# EAGLE design openmv (EAGLE 6.4)
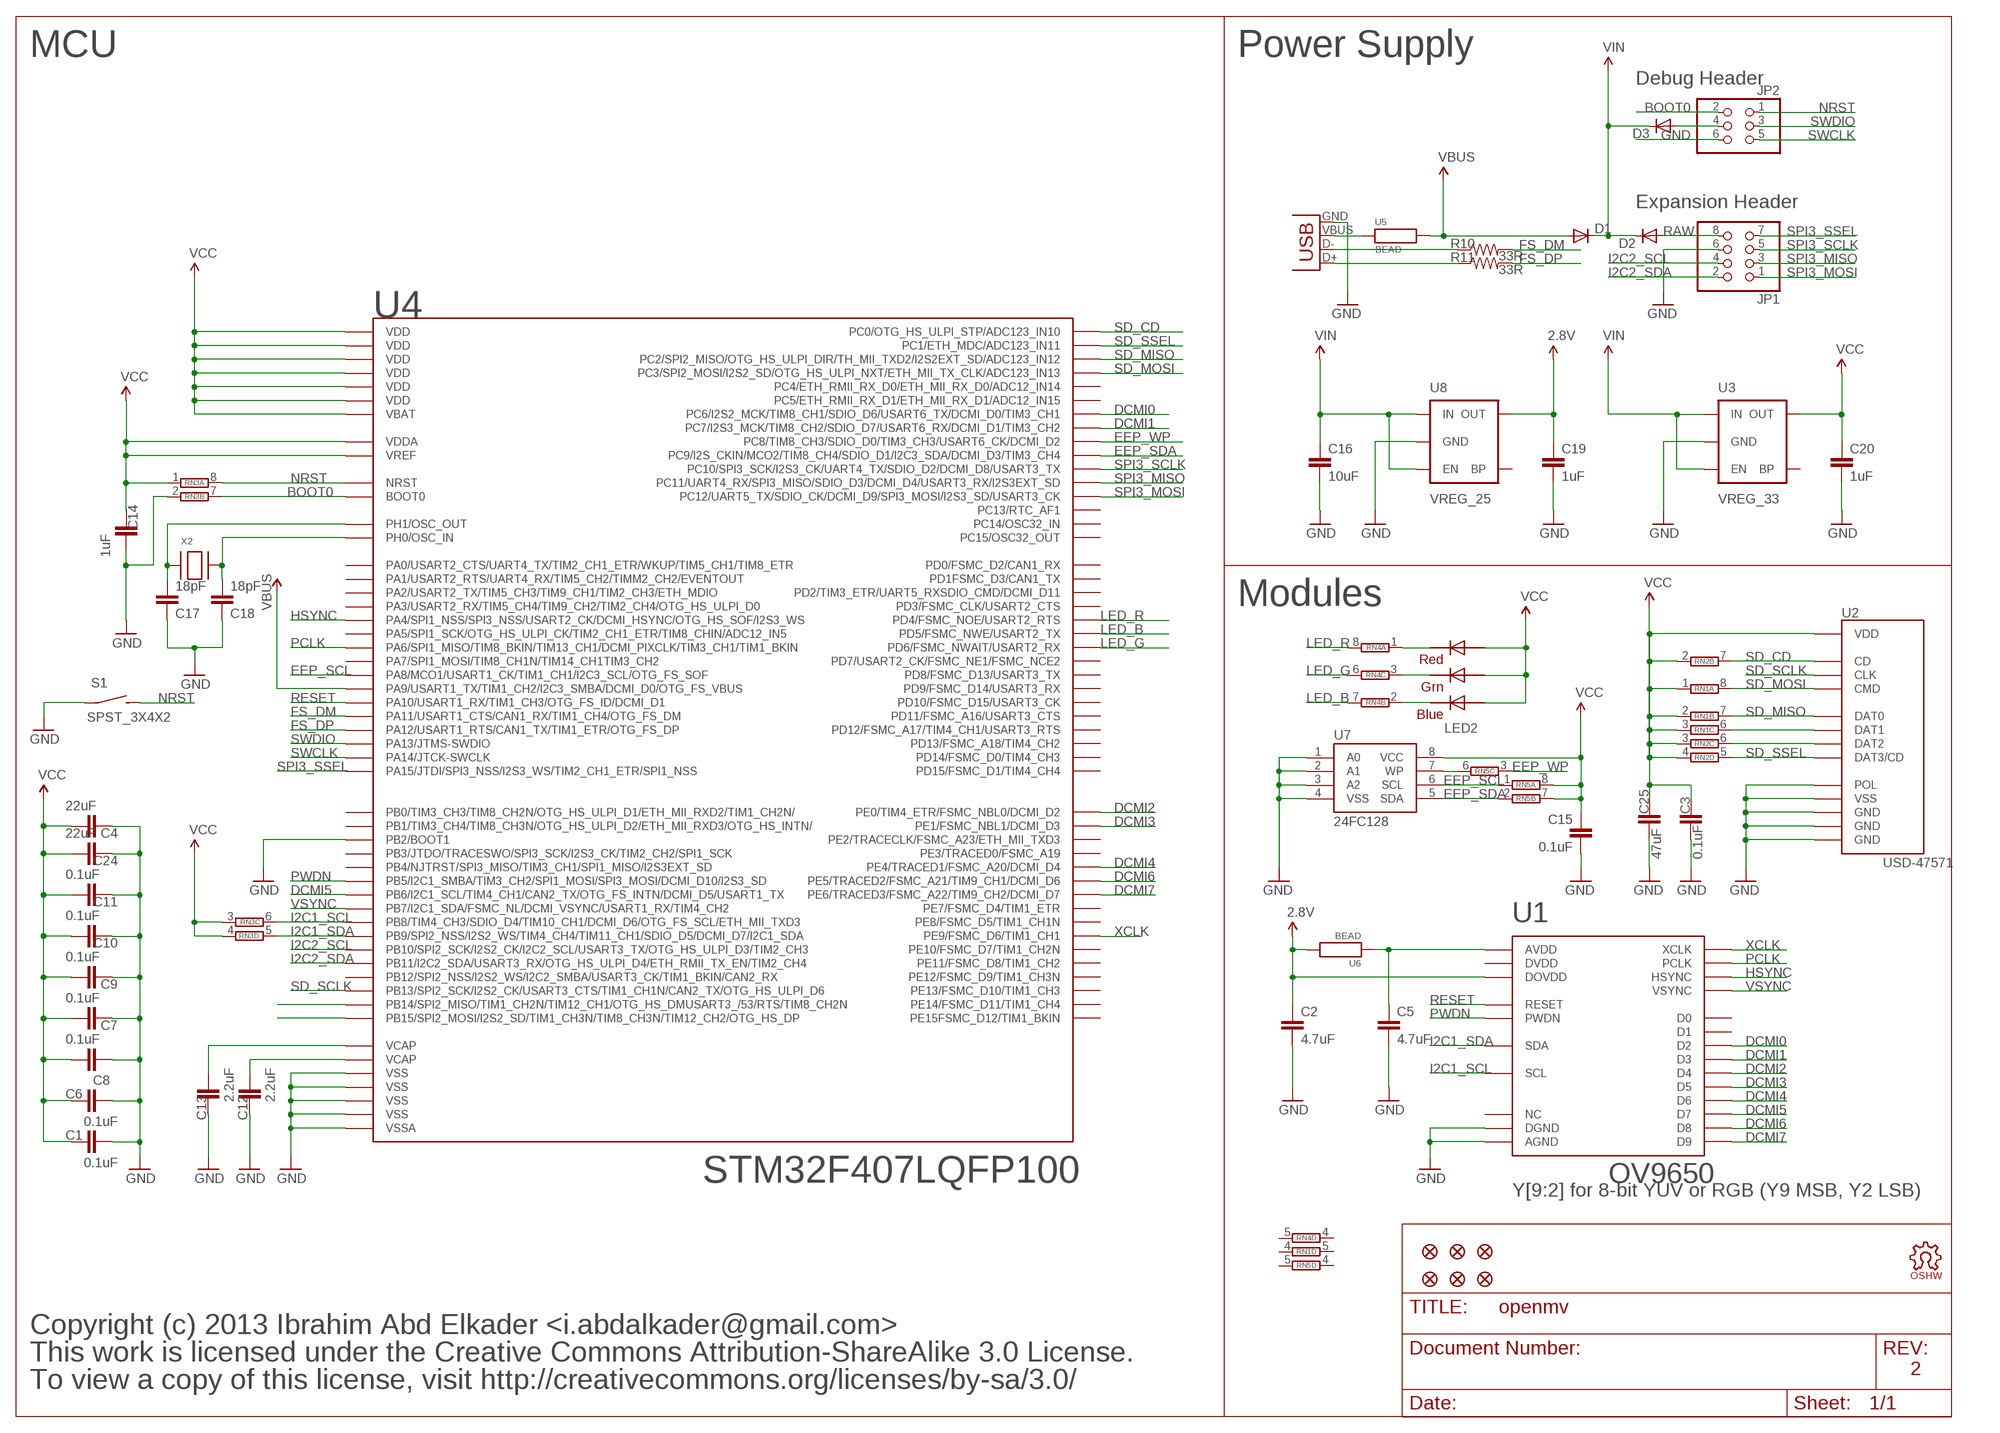
[diagram p0: schematic, sheet 1]

## Parts
C1  0.1uF  CAP0402-CAP  [0402-CAP]
C2  4.7uF  CAP0402-CAP  [0402-CAP]
C3  0.1uF  CAP0402-CAP  [0402-CAP]
C4  22uF  CAP0805  [0805]
C5  4.7uF  CAP0402-CAP  [0402-CAP]
C6  0.1uF  CAP0402-CAP  [0402-CAP]
C7  0.1uF  CAP0402-CAP  [0402-CAP]
C8  0.1uF  CAP0402-CAP  [0402-CAP]
C9  0.1uF  CAP0402-CAP  [0402-CAP]
C10  0.1uF  CAP0402-CAP  [0402-CAP]
C11  0.1uF  CAP0402-CAP  [0402-CAP]
C12  2.2uF  CAP0402-CAP  [0402-CAP]
C13  2.2uF  CAP0402-CAP  [0402-CAP]
C14  1uF  CAP0402-CAP  [0402-CAP]
C15  0.1uF  CAP0402-CAP  [0402-CAP]
C16  10uF  CAP0805  [0805]
C17  18pF  CAP0402-CAP  [0402-CAP]
C18  18pF  CAP0402-CAP  [0402-CAP]
C19  1uF  CAP0402-CAP  [0402-CAP]
C20  1uF  CAP0402-CAP  [0402-CAP]
C24  22uF  CAP0805  [0805]
C25  47uF  CAP0805  [0805]
D1  DIODESOD  [SOD-323]
D2  DIODESOD  [SOD-323]
D3  DIODESOD  [SOD-323]
JP1  PINHD-2X4  [2X04]
JP2  PINHD-2X3  [2X03]
JP3  FIDUCIAL1X2  [FIDUCIAL-1X2]
JP4  FIDUCIAL1X2  [FIDUCIAL-1X2]
JP5  FIDUCIAL1X2  [FIDUCIAL-1X2]
JP6  FIDUCIAL1X2  [FIDUCIAL-1X2]
JP7  FIDUCIAL1X2  [FIDUCIAL-1X2]
JP8  FIDUCIAL1X2  [FIDUCIAL-1X2]
LED2  RGBLED5050  [RGBLED5050]
LOGO1  OSHW_LOGO_FILLX0150-NT  [OSHW_FILLX150_NOTEXT]
R10  33R  RESISTOR0402-RES  [0402-RES]
R11  33R  RESISTOR0402-RES  [0402-RES]
RN1  4R-NCAT16  [CAT16]
RN2  4R-NCAT16  [CAT16]
RN3  4R-NCAT16  [CAT16]
RN4  4R-NCAT16  [CAT16]
RN5  4R-NCAT16  [CAT16]
S1  SPST_3X4X2  [3X4X2TACT]
U1  OV9650  [OV9650]
U2  USD-47571  [USD-47571]
U3  VREG_33  V_REG_LDOSMD  [SOT23-5]
U4  STM32F407LQFP100  [LQFP100]
U5  BEAD  [0402-CAP]
U6  BEAD  [0402-CAP]
U7  24FC128  [MSOP8]
U8  VREG_25  V_REG_LDOSMD  [SOT23-5]
X1  USB-MICROB  [USB-MICROB]
X2  XTALNX5032  [NX5032]

## Nets
2.8V: C2.1 C19.1 U1.P$11(DOVDD) U6.2 U8.5(OUT)
BOOT0: JP2.2 RN3.7 U4.94(BOOT0)
DCMI0: U1.P$19(D2) U4.63(PC6/I2S2_MCK/TIM8_CH1/SDIO_D6/USART6_TX/DCMI_D0/TIM3_CH1)
DCMI1: U1.P$21(D3) U4.64(PC7/I2S3_MCK/TIM8_CH2/SDIO_D7/USART6_RX/DCMI_D1/TIM3_CH2)
DCMI2: U1.P$22(D4) U4.97(PE0/TIM4_ETR/FSMC_NBL0/DCMI_D2)
DCMI3: U1.P$20(D5) U4.98(PE1/FSMC_NBL1/DCMI_D3)
DCMI4: U1.P$18(D6) U4.3(PE4/TRACED1/FSMC_A20/DCMI_D4)
DCMI5: U1.P$16(D7) U4.92(PB6/I2C1_SCL/TIM4_CH1/CAN2_TX/OTG_FS_INTN/DCMI_D5/USART1_TX)
DCMI6: U1.P$14(D8) U4.4(PE5/TRACED2/FSMC_A21/TIM9_CH1/DCMI_D6)
DCMI7: U1.P$12(D9) U4.5(PE6/TRACED3/FSMC_A22/TIM9_CH2/DCMI_D7)
EEP_SCL: RN5.1 U4.67(PA8/MCO1/USART1_CK/TIM1_CH1/I2C3_SCL/OTG_FS_SOF) U7.6(SCL)
EEP_SDA: RN5.2 U4.66(PC9/I2S_CKIN/MCO2/TIM8_CH4/SDIO_D1/I2C3_SDA/DCMI_D3/TIM3_CH4) U7.5(SDA)
EEP_WP: RN5.3 U4.65(PC8/TIM8_CH3/SDIO_D0/TIM3_CH3/USART6_CK/DCMI_D2)
FS_DM: R10.2 U4.70(PA11/USART1_CTS/CAN1_RX/TIM1_CH4/OTG_FS_DM)
FS_DP: R11.2 U4.71(PA12/USART1_RTS/CAN1_TX/TIM1_ETR/OTG_FS_DP)
GND: C1.1 C2.2 C3.2 C4.1 C5.2 C6.1 C7.2 C8.1 C9.2 C10.2 C11.2 C12.2 C13.2 C14.1 C15.2 C16.2 C17.1 C18.1 C19.2 C20.2 C24.1 C25.2 JP1.6 JP2.6 RN3.2 S1.P$1(P) U1.P$2(AGND) U1.P$15(DGND) U2.G$1(GND) U2.G$2(GND) U2.G$3(GND) U2.G$4(POL) U2.P$6(VSS) U3.2(GND) U4.10(VSS) U4.20(VSSA) U4.27(VSS) U4.37(PB2/BOOT1) U4.74(VSS) U4.99(VSS) U7.1(A0) U7.2(A1) U7.3(A2) U7.4(VSS) U8.2(GND) X1.GND
HSYNC: U1.P$9(HSYNC) U4.29(PA4/SPI1_NSS/SPI3_NSS/USART2_CK/DCMI_HSYNC/OTG_HS_SOF/I2S3_WS)
I2C1_SCL: RN3.6 U1.P$5(SCL) U4.95(PB8/TIM4_CH3/SDIO_D4/TIM10_CH1/DCMI_D6/OTG_FS_SCL/ETH_MII_TXD3)
I2C1_SDA: RN3.5 U1.P$3(SDA) U4.96(PB9/SPI2_NSS/I2S2_WS/TIM4_CH4/TIM11_CH1/SDIO_D5/DCMI_D7/I2C1_SDA)
I2C2_SCL: JP1.4 U4.47(PB10/SPI2_SCK/I2S2_CK/I2C2_SCL/USART3_TX/OTG_HS_ULPI_D3/TIM2_CH3)
I2C2_SDA: JP1.2 U4.48(PB11/I2C2_SDA/USART3_RX/OTG_HS_ULPI_D4/ETH_RMII_TX_EN/TIM2_CH4)
LED_B: RN4.7 U4.86(PD5/FSMC_NWE/USART2_TX)
LED_G: RN4.6 U4.87(PD6/FSMC_NWAIT/USART2_RX)
LED_R: RN4.8 U4.85(PD4/FSMC_NOE/USART2_RTS)
N$1: RN1.6 U2.P$8(DAT1)
N$2: RN2.6 U2.P$1(DAT2)
N$3: LED2.5(RED_C) RN4.1
N$4: LED2.6(GREEN_C) RN4.3
N$5: LED2.4(BLUE_C) RN4.2
N$6: C17.2 U4.13(PH1/OSC_OUT) X2.P$1
N$8: C18.2 U4.12(PH0/OSC_IN) X2.P$2
N$9: RN5.6 U7.7(WP)
N$10: C5.1 U1.P$4(AVDD) U6.1
N$11: D3.2(A) JP2.4
N$12: U4.53(PB14/SPI2_MISO/TIM1_CH2N/TIM12_CH1/OTG_HS_DMUSART3_/53/RTS/TIM8_CH2N)
N$13: U4.54(PB15/SPI2_MOSI/I2S2_SD/TIM1_CH3N/TIM8_CH3N/TIM12_CH2/OTG_HS_DP)
N$20: R10.1 X1.D-
N$21: R11.1 X1.D+
N$22: U5.1 X1.VBUS
NRST: JP2.1 RN3.8 S1.P$2(S) U4.14(NRST)
PCLK: U1.P$17(PCLK) U4.31(PA6/SPI1_MISO/TIM8_BKIN/TIM13_CH1/DCMI_PIXCLK/TIM3_CH1/TIM1_BKIN)
PWDN: U1.P$8(PWDN) U4.91(PB5/I2C1_SMBA/TIM3_CH2/SPI1_MOSI/SPI3_MOSI/DCMI_D10/I2S3_SD)
RAW: D2.2(A) JP1.8
RESET: U1.P$6(RESET) U4.69(PA10/USART1_RX/TIM1_CH3/OTG_FS_ID/DCMI_D1)
SD_CD: RN2.7 U2.G$5(CD) U4.15(PC0/OTG_HS_ULPI_STP/ADC123_IN10)
SD_MISO: RN1.7 U2.P$7(DAT0) U4.17(PC2/SPI2_MISO/OTG_HS_ULPI_DIR/TH_MII_TXD2/I2S2EXT_SD/ADC123_IN12)
SD_MOSI: RN1.8 U2.P$3(CMD) U4.18(PC3/SPI2_MOSI/I2S2_SD/OTG_HS_ULPI_NXT/ETH_MII_TX_CLK/ADC123_IN13)
SD_SCLK: U2.P$5(CLK) U4.52(PB13/SPI2_SCK/I2S2_CK/USART3_CTS/TIM1_CH1N/CAN2_TX/OTG_HS_ULPI_D6)
SD_SSEL: RN2.5 U2.P$2(DAT3/CD) U4.16(PC1/ETH_MDC/ADC123_IN11)
SPI3_MISO: JP1.3 U4.79(PC11/UART4_RX/SPI3_MISO/SDIO_D3/DCMI_D4/USART3_RX/I2S3EXT_SD)
SPI3_MOSI: JP1.1 U4.80(PC12/UART5_TX/SDIO_CK/DCMI_D9/SPI3_MOSI/I2S3_SD/USART3_CK)
SPI3_SCLK: JP1.5 U4.78(PC10/SPI3_SCK/I2S3_CK/UART4_TX/SDIO_D2/DCMI_D8/USART3_TX)
SPI3_SSEL: JP1.7 U4.77(PA15/JTDI/SPI3_NSS/I2S3_WS/TIM2_CH1_ETR/SPI1_NSS)
SWCLK: JP2.5 U4.76(PA14/JTCK-SWCLK)
SWDIO: JP2.3 U4.72(PA13/JTMS-SWDIO)
VBUS: D1.2(A) U4.68(PA9/USART1_TX/TIM1_CH2/I2C3_SMBA/DCMI_D0/OTG_FS_VBUS) U5.2
VCAP1: C13.1 U4.49(VCAP)
VCAP2: C12.1 U4.73(VCAP)
VCC: C1.2 C3.1 C4.2 C6.2 C7.1 C8.2 C9.1 C10.1 C11.1 C14.2 C15.1 C20.1 C24.2 C25.1 LED2.1(GREEN_A) LED2.2(RED_A) LED2.3(BLUE_A) RN1.1 RN1.2 RN1.3 RN2.2 RN2.3 RN2.4 RN3.1 RN3.3 RN3.4 RN5.7 RN5.8 U2.P$4(VDD) U3.5(OUT) U4.6(VBAT) U4.11(VDD) U4.19(VDD) U4.21(VREF) U4.22(VDDA) U4.28(VDD) U4.50(VDD) U4.75(VDD) U4.100(VDD) U7.8(VCC)
VIN: C16.1 D1.1(C) D2.1(C) D3.1(C) U3.1(IN) U3.3(EN) U8.1(IN) U8.3(EN)
VSYNC: U1.P$7(VSYNC) U4.93(PB7/I2C1_SDA/FSMC_NL/DCMI_VSYNC/USART1_RX/TIM4_CH2)
XCLK: U1.P$13(XCLK) U4.40(PE9/FSMC_D6/TIM1_CH1)
Unconnected: RN1.4 RN1.5 RN2.1 RN2.8 RN4.4 RN4.5 RN5.4 RN5.5 U1.P$1(NC) U1.P$10(DVDD) U1.P$23(D1) U1.P$24(D0) U3.4(BP) U4.1(PE2/TRACECLK/FSMC_A23/ETH_MII_TXD3) U4.2(PE3/TRACED0/FSMC_A19) U4.7(PC13/RTC_AF1) U4.8(PC14/OSC32_IN) U4.9(PC15/OSC32_OUT) U4.23(PA0/USART2_CTS/UART4_TX/TIM2_CH1_ETR/WKUP/TIM5_CH1/TIM8_ETR) U4.24(PA1/USART2_RTS/UART4_RX/TIM5_CH2/TIMM2_CH2/EVENTOUT) U4.25(PA2/USART2_TX/TIM5_CH3/TIM9_CH1/TIM2_CH3/ETH_MDIO) U4.26(PA3/USART2_RX/TIM5_CH4/TIM9_CH2/TIM2_CH4/OTG_HS_ULPI_D0) U4.30(PA5/SPI1_SCK/OTG_HS_ULPI_CK/TIM2_CH1_ETR/TIM8_CHIN/ADC12_IN5) U4.32(PA7/SPI1_MOSI/TIM8_CH1N/TIM14_CH1TIM3_CH2) U4.33(PC4/ETH_RMII_RX_D0/ETH_MII_RX_D0/ADC12_IN14) U4.34(PC5/ETH_RMII_RX_D1/ETH_MII_RX_D1/ADC12_IN15) U4.35(PB0/TIM3_CH3/TIM8_CH2N/OTG_HS_ULPI_D1/ETH_MII_RXD2/TIM1_CH2N/) U4.36(PB1/TIM3_CH4/TIM8_CH3N/OTG_HS_ULPI_D2/ETH_MII_RXD3/OTG_HS_INTN/) U4.38(PE7/FSMC_D4/TIM1_ETR) U4.39(PE8/FSMC_D5/TIM1_CH1N) U4.41(PE10/FSMC_D7/TIM1_CH2N) U4.42(PE11/FSMC_D8/TIM1_CH2) U4.43(PE12/FSMC_D9/TIM1_CH3N) U4.44(PE13/FSMC_D10/TIM1_CH3) U4.45(PE14/FSMC_D11/TIM1_CH4) U4.46(PE15FSMC_D12/TIM1_BKIN) U4.51(PB12/SPI2_NSS/I2S2_WS/I2C2_SMBA/USART3_CK/TIM1_BKIN/CAN2_RX) U4.55(PD8/FSMC_D13/USART3_TX) U4.56(PD9/FSMC_D14/USART3_RX) U4.57(PD10/FSMC_D15/USART3_CK) U4.58(PD11/FSMC_A16/USART3_CTS) U4.59(PD12/FSMC_A17/TIM4_CH1/USART3_RTS) U4.60(PD13/FSMC_A18/TIM4_CH2) U4.61(PD14/FSMC_D0/TIM4_CH3) U4.62(PD15/FSMC_D1/TIM4_CH4) U4.81(PD0/FSMC_D2/CAN1_RX) U4.82(PD1FSMC_D3/CAN1_TX) U4.83(PD2/TIM3_ETR/UART5_RXSDIO_CMD/DCMI_D11) U4.84(PD3/FSMC_CLK/USART2_CTS) U4.88(PD7/USART2_CK/FSMC_NE1/FSMC_NCE2) U4.89(PB3/JTDO/TRACESWO/SPI3_SCK/I2S3_CK/TIM2_CH2/SPI1_SCK) U4.90(PB4/NJTRST/SPI3_MISO/TIM3_CH1/SPI1_MISO/I2S3EXT_SD) U8.4(BP)

## Notes on the sheet
- MCU | Power Supply
- Debug Header
- Expansion Header
- Modules
- Y[9:2] for 8-bit YUV or RGB (Y9 MSB, Y2 LSB)
- Copyright (c) 2013 Ibrahim Abd Elkader <i.abdalkader@gmail.com>
- This work is licensed under the Creative Commons Attribution-ShareAlike 3.0 License.
- 2
- To view a copy of this license, visit http://creativecommons.org/licenses/by-sa/3.0/

## Library data of the parts
C1-C20 C24 C25 = sfe:CAP: Capacitor Standard 0603 ceramic capacitor, and 0.1" leaded capacitor.
D1-D3 = sfe:DIODE: Diode These are standard reverse protection diodes and small signal diodes. SMA package can handle up to about 1A. SOD-323 can handle about 200mA. What the SOD-323 package when ordering, there are some mfgs out there that are 5-pin packages.
JP1 = pinhead:PINHD-2X4: PIN HEADER
JP2 = mux:PINHD-2X3: PIN HEADER
JP3-JP8 = sfe:FIDUCIAL: Fiducial Alignment Points Various fiducial points for machine vision alignment.
LED2 = adafruit:RGBLED: For 5050 RGB LEDs, the order of the LEDs may vary from one manufacturer to another!
LOGO1 = iofault:OSHW_LOGO_FILL
R10 R11 = sfe:RESISTOR: Resistor Basic schematic elements and footprints for 0603, 1206, and PTH resistors.
RN1-RN5 = resistor-dil:4R-N: Array Chip Resistor Source: RS Component / Phycomp; OC_FARNELL: unknown; OC_NEWARK: unknown
S1 = bt_electromech:SPST: SPST SWITCH
U1 = iofault:OV9650
U2 = mux:USD-47571
U3 U8 = sfe:V_REG_LDO: Voltage Regulator LDO Standard 150mA LDO voltage regulator in SOT-23 layout. Micrel part MIC5205. BP (by-pass) pin is used to lower output noise with 470pF cap.
U4 = mux:STM32F407
U5 U6 = heka:BEAD
U7 = mux:24FC128
X1 = sfe:USB: USB Connectors USB-B-PTH is fully proven SKU : PRT-00139 USB-miniB is fully proven SKU : PRT-00587 USB-A-PCB is untested. USB-A-H is throughly reviewed, but untested. Spark Fun Electronics SKU : PRT-00437 USB-B-SMT is throughly reviewed, but untested. Needs silkscreen touching up. USB-A-S has not been used/tested USB-MB-H has not been used/tested
X2 = adafruit:XTAL: Low cost SMT crystals, no capacitors included http://www.ladyada.net/library/eagle

## Net classes
0 default: width 0.152 mm

## Board
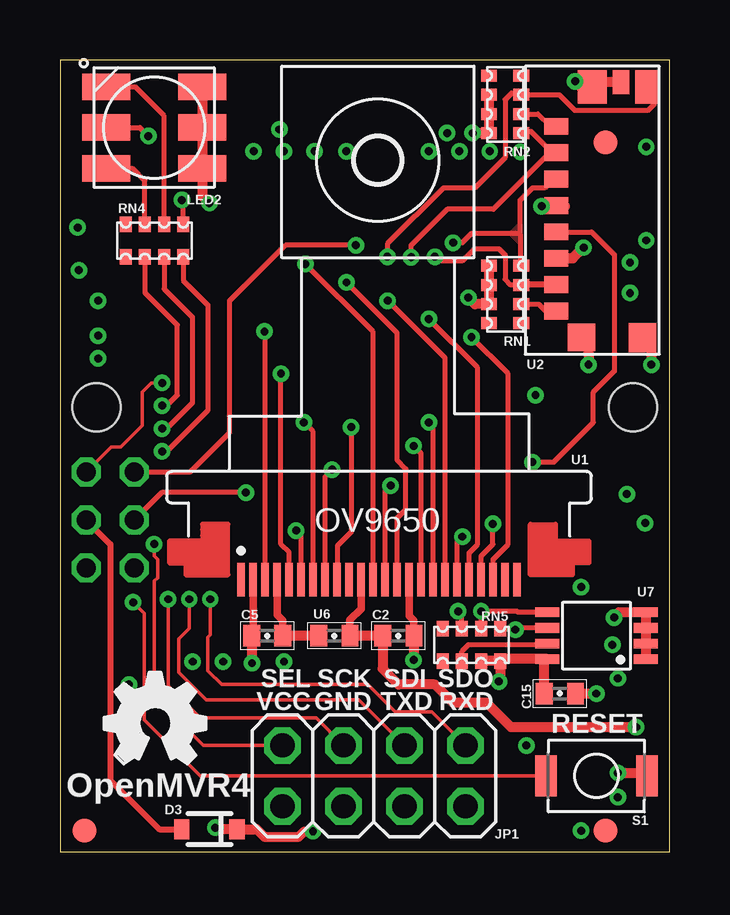
[diagram p1: board, top side]
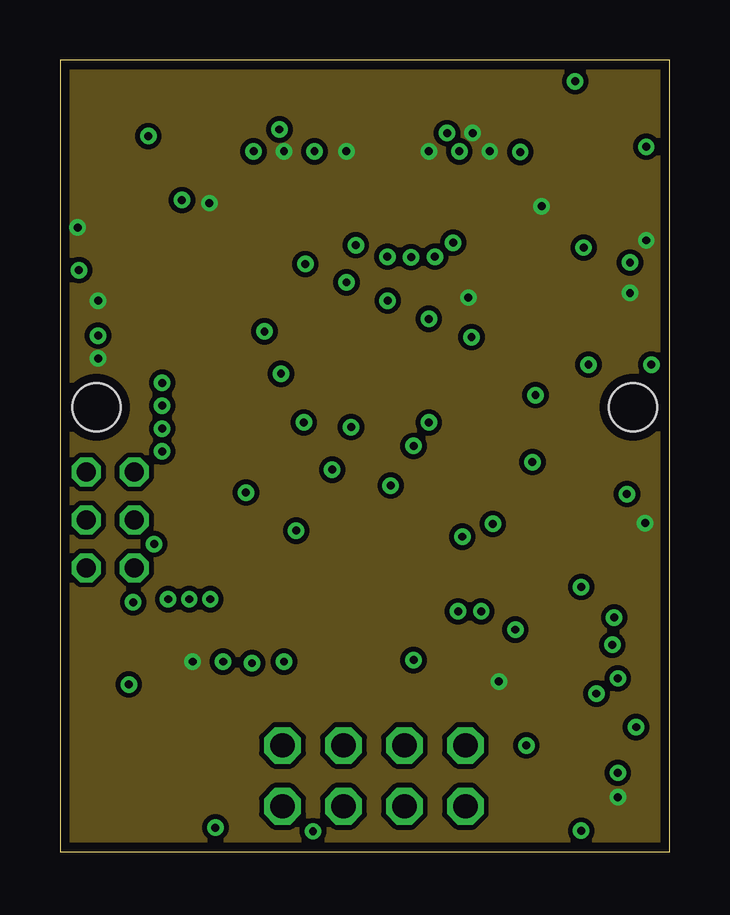
[diagram p2: board, inner layer Route2]
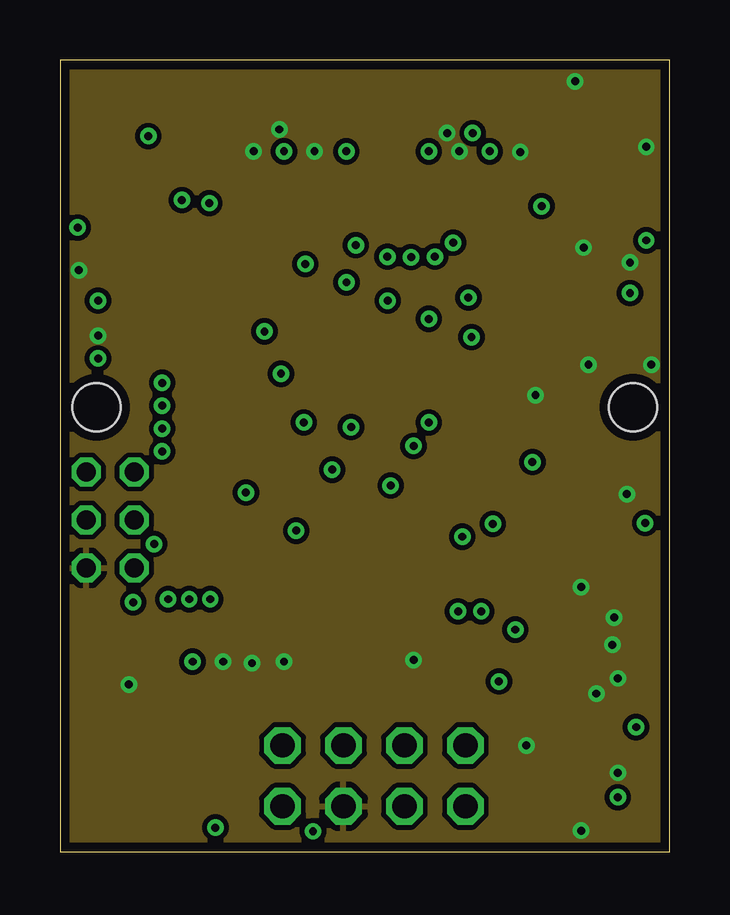
[diagram p3: board, inner layer Route15]
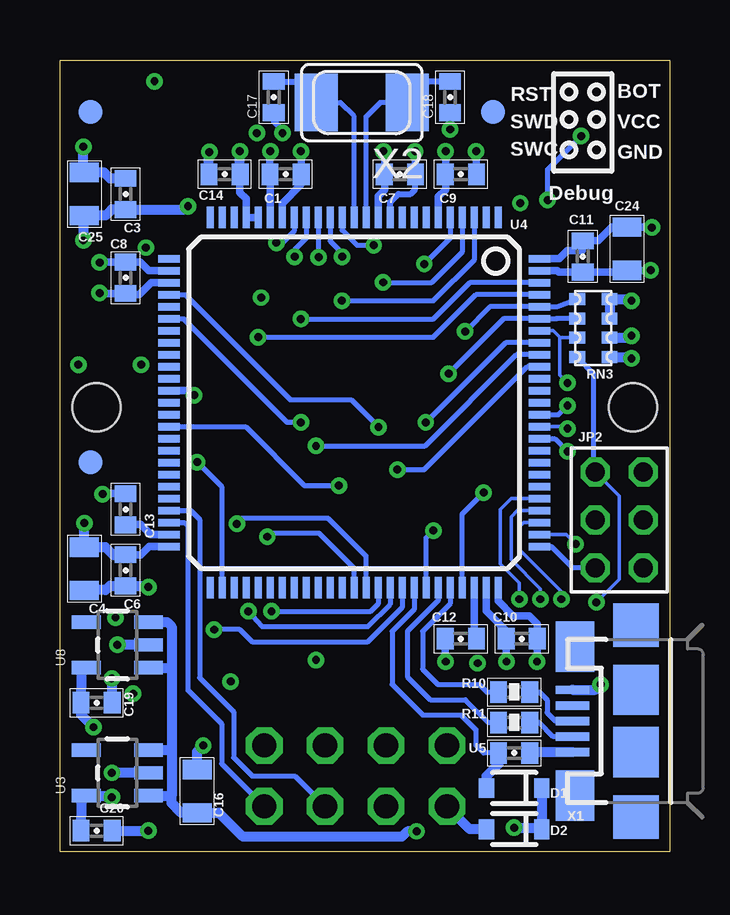
[diagram p4: board, bottom side, seen from below]

Size 25.4 x 33.02 mm. Coordinates in mm from the lower left corner, seen from the top.
Outline: 0,0 25.4,0 25.4,33.02 0,33.02 0,0
Copper layers (1*16): Top 0.0356mm / dielectric 1.5011mm / Bottom 0.0356mm
Design rules "LaenPCBOrder": minimum track width 6mil, minimum drill 13mil, track to track 6mil, track to pad 6mil, pad to pad 6mil, via to via 6mil, smd to smd 6mil, copper to edge 15mil, drill to drill 6mil, minimum pad ring 7mil, minimum via ring 7mil, stop-mask expansion 4mil, vias tented up to drill 20mil, thermal gap 10mil
Holes 2 mm at 1.52,18.54 23.88,18.54

### Footprints (pad centres in the part's own frame; a part is rotated, then mirrored left to right if it is on the bottom)
0402-CAP = smd 0.7 x 0.9: 1 -0.65,0; 2 0.65,0
0805 = smd 0.8 x 1.2: 1 -0.9,0; 2 0.9,0
SOD-323 = smd 0.63 x 0.83: 1 -1.15,0; 2 1.15,0
2X04 = drill 1.016 octagon: 1 -3.81,-1.27; 2 -3.81,1.27; 3 -1.27,-1.27; 4 -1.27,1.27; 5 1.27,-1.27; 6 1.27,1.27; 7 3.81,-1.27; 8 3.81,1.27
2X03 = drill 0.8 octagon: 1 -2,-1; 2 -2,1; 3 0,-1; 4 0,1; 5 2,-1; 6 2,1
FIDUCIAL-1X2 = smd 1 x 1: 1 0,0
RGBLED5050 = smd 2 x 1.1: 1 -2,1.7; 2 -2,0; 3 -2,-1.7; 4 2,-1.7; 5 2,0; 6 2,1.7
0402-RES = smd 0.7 x 0.9: 1 -0.65,0; 2 0.65,0
CAT16 = smd 0.5 x 0.65: 1 -1.2,-0.675; 2 -0.4,-0.675; 3 0.4,-0.675; 4 1.2,-0.675; 5 1.2,0.675; 6 0.4,0.675; 7 -0.4,0.675; 8 -1.2,0.675
3X4X2TACT = smd 0.9 x 1.7: P$1 -2.1,0; P$2 2.1,0
OV9650 = smd 0.3 x 1.4: P$1 -5.6,-11.5; P$2 -5.1,-11.5; P$3 -4.6,-11.5; P$4 -4.1,-11.5; P$5 -3.6,-11.5; P$6 -3.1,-11.5; P$7 -2.6,-11.5; P$8 -2.1,-11.5; P$9 -1.6,-11.5; P$10 -1.1,-11.5; P$11 -0.6,-11.5; P$12 -0.1,-11.5; P$13 0.4,-11.5; P$14 0.9,-11.5; P$15 1.4,-11.5; P$16 1.9,-11.5; P$17 2.4,-11.5; P$18 2.9,-11.5; P$19 3.4,-11.5; P$20 3.9,-11.5; P$21 4.4,-11.5; P$22 4.9,-11.5; P$23 5.4,-11.5; P$24 5.9,-11.5
USD-47571 = smd 1.15 x 1.15: G$1 -4.9,0.55 | smd 1.2 x 1.15: G$2 -4.9,-2 | smd 1.4 x 1.2: G$3 5.55,0.1 | smd 1 x 0.7: G$4 5.75,-1.1 | smd 1.4 x 0.9: G$5 5.55,-2.15 | smd 0.7 x 1: P$1 3.9,1.6; P$2 2.8,1.6; P$3 1.7,1.6; P$4 0.6,1.6; P$5 -0.5,1.6; P$6 -1.6,1.6; P$7 -2.7,1.6; P$8 -3.8,1.6
SOT23-5 = smd 0.55 x 1.2: 1 -0.95,-1.3; 2 0,-1.3; 3 0.95,-1.3; 4 0.95,1.3; 5 -0.95,1.3
LQFP100 = smd 0.9 x 0.3: 1 -7.72,6; 2 -7.72,5.5; 3 -7.72,5; 4 -7.72,4.5; 5 -7.72,4; 6 -7.72,3.5; 7 -7.72,3; 8 -7.72,2.5; 9 -7.72,2; 10 -7.72,1.5; 11 -7.72,1; 12 -7.72,0.5; 13 -7.72,0; 14 -7.72,-0.5; 15 -7.72,-1; 16 -7.72,-1.5; 17 -7.72,-2; 18 -7.72,-2.5; 19 -7.72,-3; 20 -7.72,-3.5; 21 -7.72,-4; 22 -7.72,-4.5; 23 -7.72,-5; 24 -7.72,-5.5; 25 -7.72,-6; 51 7.72,-6; 52 7.72,-5.5; 53 7.72,-5; 54 7.72,-4.5; 55 7.72,-4; 56 7.72,-3.5; 57 7.72,-3; 58 7.72,-2.5; 59 7.72,-2; 60 7.72,-1.5; 61 7.72,-1; 62 7.72,-0.5; 63 7.72,0; 64 7.72,0.5; 65 7.72,1; 66 7.72,1.5; 67 7.72,2; 68 7.72,2.5; 69 7.72,3; 70 7.72,3.5; 71 7.72,4; 72 7.72,4.5; 73 7.72,5; 74 7.72,5.5; 75 7.72,6 | smd 0.3 x 0.9: 26 -6,-7.72; 27 -5.5,-7.72; 28 -5,-7.72; 29 -4.5,-7.72; 30 -4,-7.72; 31 -3.5,-7.72; 32 -3,-7.72; 33 -2.5,-7.72; 34 -2,-7.72; 35 -1.5,-7.72; 36 -1,-7.72; 37 -0.5,-7.72; 38 0,-7.72; 39 0.5,-7.72; 40 1,-7.72; 41 1.5,-7.72; 42 2,-7.72; 43 2.5,-7.72; 44 3,-7.72; 45 3.5,-7.72; 46 4,-7.72; 47 4.5,-7.72; 48 5,-7.72; 49 5.5,-7.72; 50 6,-7.72; 76 6,7.72; 77 5.5,7.72; 78 5,7.72; 79 4.5,7.72; 80 4,7.72; 81 3.5,7.72; 82 3,7.72; 83 2.5,7.72; 84 2,7.72; 85 1.5,7.72; 86 1,7.72; 87 0.5,7.72; 88 0,7.72; 89 -0.5,7.72; 90 -1,7.72; 91 -1.5,7.72; 92 -2,7.72; 93 -2.5,7.72; 94 -3,7.72; 95 -3.5,7.72; 96 -4,7.72; 97 -4.5,7.72; 98 -5,7.72; 99 -5.5,7.72; 100 -6,7.72
MSOP8 = smd 0.4 x 1: 1 -0.975,-2.05; 2 -0.325,-2.05; 3 0.325,-2.05; 4 0.975,-2.05; 5 0.975,2.05; 6 0.325,2.05; 7 -0.325,2.05; 8 -0.975,2.05
USB-MICROB = smd 0.35 x 1.4: D+ 0,2.65; D- -0.65,2.65; GND 1.3,2.65; ID 0.65,2.65; VBUS -1.3,2.65 | smd 1.8 x 1.9: MT1 -4,0; MT2 4,0 | smd 2.1 x 1.6: MT3 3.1,2.55; MT4 -3.1,2.55 | smd 2.1 x 1.9: MT5 -1.3,0; MT6 1.3,0
NX5032 = smd 1.8 x 2.4: P$1 1.9,0; P$2 -1.9,0

### Placement (x,y rotation side)
C1  16,28.26 0 bottom
C2  14.1,9.02 0 top
C3  22.67,27.43 90 bottom
C4  24.38,11.81 90 bottom
C5  8.64,9.02 180 top
C6  22.67,11.75 90 bottom
C7  11.24,28.26 0 bottom
C8  22.67,23.94 270 bottom
C9  8.7,28.26 0 bottom
C10  6.16,8.89 180 bottom
C11  3.62,24.83 270 bottom
C12  8.7,8.89 180 bottom
C13  22.67,14.29 90 bottom
C14  18.54,28.26 0 bottom
C15  20.83,6.6 0 top
C16  19.68,2.54 90 bottom
C17  16.49,31.47 90 bottom
C18  9.15,31.47 90 bottom
C19  23.88,6.22 0 bottom
C20  23.88,0.89 0 bottom
C24  1.78,25.15 90 bottom
C25  24.38,27.43 90 bottom
D1  6.48,2.67 180 bottom
D2  6.48,0.95 180 bottom
D3  6.22,0.95 180 top
JP1  13.08,3.17 180 top
JP2  2.1,13.84 270 bottom
JP3  22.73,29.59 0 top
JP4  22.73,0.89 0 top
JP5  1.02,0.89 0 top
JP6  24.13,30.86 0 bottom
JP7  24.13,16.26 0 bottom
JP8  7.37,30.86 0 bottom
LED2  3.93,30.2 180 top
LOGO1  1.84,3.68 0 top
R10  6.48,5.4 180 bottom
R11  6.48,6.67 180 bottom
RN1  18.54,23.24 270 top
RN2  18.54,31.17 270 top
RN3  3.17,21.84 90 bottom
RN4  3.94,25.49 180 top
RN5  17.14,8.64 180 top
S1  22.35,3.17 180 top
U1  13.14,22.86 0 top
U2  22.28,26.35 90 top
U3  23.01,3.3 90 bottom
U4  13.14,18.73 270 bottom
U5  6.48,4.13 180 bottom
U6  11.43,9.02 0 top
U7  22.35,9.02 90 top
U8  23.01,8.64 90 bottom
X1  1.4,5.46 90 bottom
X2  12.83,31.24 180 bottom

### Tracks (layer width: path | path; a pad name or v marks a point on that pad's centre or on a via)
2.8V  (via drill 0.33)
  Top 0.305: U1.P$11 12.54,10.13 12.08,9.67 U6.2
  Top 0.406: U6.2 C2.1 13.45,7.63 14.1,6.99 15.62,6.99 16.38,6.22 17.78,6.22 18.8,5.21 v24,5.21
  Bottom 0.406: U8.5 24.52,7.46 C19.1 24.53,5.73 v24,5.21
BOOT0  (via drill 0.33)
  Top 0.152: v4.25,19.56 3.81,19.56 3.43,19.18 3.43,17.78 2.54,16.89 2.14,16.89 JP2.2
  Bottom 0.152: U4.94 4.84,21.73 4.57,21.46 4.57,21.44 | 4.57,21.44 4.57,19.88 v4.25,19.56 | RN3.7 4.57,21.44
DCMI0  (via drill 0.33)
  Top 0.203: U1.P$19 16.54,12.93 v16.76,13.14
  Bottom 0.203: U4.63 13.14,11.82 14.61,13.28 16.65,13.28 v16.76,13.14
DCMI1  (via drill 0.33)
  Top 0.203: U1.P$21 17.54,12.34 18.03,12.83 v18.03,13.68
  Bottom 0.203: U4.64 12.64,12.33 14.22,13.91 17.81,13.91 v18.03,13.68
DCMI2  (via drill 0.33)
  Top 0.203: v17.14,21.46 18.67,19.94 18.67,12.83 18.04,12.2 U1.P$22
  Bottom 0.203: v17.14,21.46 9.84,21.46 8.07,23.23 U4.97
DCMI3  (via drill 0.33)
  Top 0.203: v15.37,22.23 17.4,20.19 17.4,12.83 17.04,12.47 U1.P$20
  Bottom 0.203: v15.37,22.23 9.84,22.23 8.34,23.73 U4.98
DCMI4  (via drill 0.33)
  Top 0.203: v13.65,22.99 16.04,20.59 U1.P$18
  Bottom 0.203: v13.65,22.99 9.84,22.99 8.14,24.68 U4.3
DCMI5  (via drill 0.33)
  Top 0.203: v14.73,16.93 15.04,16.61 U1.P$16
  Bottom 0.203: v14.73,16.93 10.19,16.93 6.38,20.73 U4.92
DCMI6  (via drill 0.33)
  Top 0.203: v11.94,23.75 14.04,21.64 14.04,16.34 14.41,15.97 14.41,14.29 14.04,13.92 U1.P$14
  Bottom 0.203: v11.94,23.75 9.91,23.75 8.64,25.01 U4.4
DCMI7  (via drill 0.33)
  Top 0.203: v10.22,24.51 13.04,21.69 U1.P$12
  Bottom 0.203: U4.5 9.14,25.59 v10.22,24.51
EEP_SCL  (via drill 0.33)
  Top 0.203: U7.6 19.05,9.34 v18.97,9.27 18.39,9.27 RN5.1
  Bottom 0.203: U4.67 11.14,10.19 12.57,8.76 17.4,8.76 17.91,9.27 v18.97,9.27
EEP_SDA  (via drill 0.33)
  Top 0.203: U7.5 19.09,9.99 19.05,10.03 v17.55,10.03 RN5.2
  Bottom 0.203: v17.55,10.03 16.99,9.4 12.57,9.4 11.64,10.33 U4.66
EEP_WP  (via drill 0.33)
  Top 0.203: RN5.3 16.75,9.87 v16.59,10.03
  Bottom 0.203: v16.59,10.03 12.45,10.03 12.14,10.34 U4.65
FS_DM
  Bottom 0.203: U4.70 9.64,10.48 10.92,9.21 10.92,7.3 9.97,6.35 8.51,6.35 7.56,5.4 R10.2
FS_DP
  Bottom 0.203: U4.71 9.14,10.35 10.29,9.21 10.29,7.62 9.65,6.99 7.94,6.99 7.62,6.67 R11.2
GND  (via drill 0.33)
  Top 0.305: U1.P$15 14.54,9.84 14.73,9.65 14.73,9.03 C2.2 | U1.P$2 8.04,9.07 C5.2
  Top 0.406: U2.G$1 22.02,21.12 v22.02,20.32 | 20.46,24.75 U2.P$6 21.37,24.75 v21.82,25.2 | U2.G$4 22.77,32.1 U2.G$3 21.69,31.9 v21.46,32.13 | U2.G$2 24.64,21.42 v24.64,20.32 | C5.2 7.99,7.89 v8,7.87 | C2.2 14.75,8.02 v14.73,8 | U7.1 U7.2 U7.3 U7.4 23.3,9.99 v23.09,9.78 | C15.2 v22.35,6.6 | v23.24,3.3 24.32,3.3 S1.P$1
  Bottom 0.203: 19.19,29.17 v19.18,29.18
  Bottom 0.254: U4.10 11.64,27.09 11.3,27.43 10.79,27.43 10.6,27.62 10.6,28.24 C7.2 | C17.1 16.49,30.46 16.13,30.1 v16.13,29.97 | C18.1 9.15,30.23 v9.14,30.12
  Bottom 0.305: C13.2 23.61,14.94 v23.62,14.92 | v6.79,7.94 6.81,7.95 C10.2 6.79,8.9 6.79,9.21 7.64,10.06 U4.74 | C7.2 10.59,29.2 v10.6,29.21 | C9.2 8.05,29.2 v8.06,29.21 | v16.64,29.21 16.65,29.2 C1.1 U4.20 | U4.37 19.99,19.23 v19.81,19.05 | C12.2 9.35,7.95 v9.34,7.94 | U4.27 21.69,24.23 22.05,24.59 C8.1 23.73,24.59 v23.75,24.57 | U4.99 4.67,24.23 4.62,24.18 C11.2 1.84,24.18 C24.1 0.65,24.25 v0.79,24.26
  Bottom 0.406: RN3.2 1.67,21.44 v1.59,21.53 | 19.18,28.26 C14.1 19.19,29.17 | C3.2 23.31,28.08 23.56,28.33 C25.2 24.43,28.38 v24.43,29.4 | X1.GND 3.09,6.76 v2.87,6.99 | C4.1 24.37,10.92 23.5,10.92 23.32,11.1 C6.1 21.77,11.1 v21.72,11.05 | U3.2 v23.24,3.3 | U8.2 v23.01,8.64 | C19.2 23.23,7.22 v23.24,7.24 | C20.2 v21.72,0.89 | C16.2 19.68,4.19 v19.43,4.45
  pour Route15 (isolate 0.203): 0,0 0,33.02 25.4,33.02 25.4,0
HSYNC  (via drill 0.33)
  Top 0.203: v12.13,17.72 12.13,13.34 11.56,12.76 11.56,11.37 U1.P$9
  Bottom 0.203: U4.29 20.18,23.23 15.81,18.86 13.27,18.86 v12.13,17.72
I2C1_SCL  (via drill 0.33)
  Top 0.203: U1.P$5 9.54,12.49 9.21,12.83 v9.21,19.94
  Bottom 0.203: v9.21,19.94 6.91,22.23 U4.95 4.71,22.23 4.72,22.24 RN3.6
I2C1_SDA  (via drill 0.33)
  Top 0.203: U1.P$3 8.54,21.68 v8.52,21.7
  Bottom 0.203: v8.52,21.7 7.49,22.73 U4.96 4.68,22.73 RN3.5
I2C2_SCL
  Bottom 0.203: U4.47 19.95,14.23 19.58,13.87 19.58,7.26 18.16,5.84 18.16,3.94 17.4,3.17 15.62,3.17 JP1.4
I2C2_SDA
  Bottom 0.203: U4.48 20.21,13.73 20.07,13.59 20.07,6.73 18.67,5.33 18.67,3.68 JP1.2
LED_B  (via drill 0.33)
  Top 0.203: RN4.7 4.34,23.47 5.52,22.29 5.52,18.73 4.45,17.65 v4.25,17.65
  Bottom 0.152: U4.86 4.33,17.73 v4.25,17.65
LED_G  (via drill 0.33)
  Top 0.203: RN4.6 3.54,23.32 4.89,21.97 4.89,19.05 4.45,18.61 v4.25,18.61
  Bottom 0.203: U4.87 4.63,18.23 v4.25,18.61
LED_R  (via drill 0.33)
  Top 0.203: RN4.8 5.14,23.83 6.16,22.8 6.16,18.41 4.45,16.7 v4.25,16.7
  Bottom 0.203: U4.85 4.79,17.23 v4.25,16.7
N$1
  Top 0.203: U2.P$8 20.25,22.55 19.96,22.84 RN1.6
N$2
  Top 0.203: U2.P$1 20.42,30.25 19.91,30.77 RN2.6
N$3  (via drill 0.33)
  Top 0.203: RN4.1 5.14,27.12 v5.08,27.18 | 3.43,30.1 v3.68,29.84 3.33,30.2 LED2.5
  Bottom 0.203: v5.08,27.18 5.08,28.45 v3.68,29.84
N$4
  Top 0.203: RN4.3 3.54,27.99 3.03,28.5 LED2.6
N$5
  Top 0.203: RN4.2 4.34,30.69 3.13,31.9 | LED2.4 3.13,31.9 | 3.13,31.9
N$6
  Bottom 0.203: U4.13 13.14,30.67 13.72,31.24 14.22,31.24 X2.P$1
  Bottom 0.254: C17.2 15.11,32.12 14.22,31.24
N$8
  Bottom 0.203: U4.12 12.64,30.66 12.06,31.24 X2.P$2
  Bottom 0.254: C18.2 10.05,32.12 X2.P$2
N$9
  Top 0.203: RN5.6 16.75,8.36 17.02,8.64 20.25,8.64 U7.7
N$10
  Top 0.305: U1.P$4 9.04,9.88 9.27,9.65 9.27,9.03 C5.1
  Top 0.406: U6.1 C5.1
N$11
  Top 0.254: JP2.4 1.09,13.83 2.1,12.83 2.1,2.98 4.13,0.95 D3.2
N$20
  Bottom 0.203: X1.D- 4.85,4.81 5.43,5.4 R10.1
N$21
  Bottom 0.203: R11.1 5.42,6.67 5.11,6.35 5.11,5.81 4.76,5.46 X1.D+
N$22
  Bottom 0.406: X1.VBUS 5.79,4.16 U5.1
NRST  (via drill 0.33)
  Top 0.152: S1.P$2 5.84,3.17 3.5,5.51 3.5,9.96 v3.05,10.41
  Top 0.203: v12.33,25.3 9.39,25.3 7.06,22.97 7.06,17.47 5.43,15.84 JP2.1
  Bottom 0.152: v3.05,10.41 2.1,11.37 2.1,14.84 JP2.1
  Bottom 0.203: U4.14 13.64,25.92 13.03,25.3 v12.33,25.3 | RN3.8 3.5,20.26 3.17,19.94 3.17,15.92 JP2.1
PCLK  (via drill 0.33)
  Top 0.203: U1.P$17 15.54,17.73 v15.37,17.91
  Bottom 0.203: U4.31 20.26,22.23 15.94,17.91 v15.37,17.91
PWDN  (via drill 0.33)
  Top 0.203: U1.P$8 11.04,15.64 v11.34,15.94
  Bottom 0.203: v11.34,15.94 10.22,15.94 5.93,20.23 U4.91
RAW
  Bottom 0.406: D2.2 8.32,0.95 JP1.8
RESET  (via drill 0.33)
  Top 0.203: U1.P$6 10.04,13.2 v9.84,13.4
  Bottom 0.203: U4.69 10.14,13.1 v9.84,13.4
SD_CD  (via drill 0.33)
  Top 0.203: U2.G$5 24.79,31.22 24.49,30.91 21.46,30.91 20.81,31.57 RN2.7 18.82,31.64 18.54,31.37 18.54,28.96 17.27,27.69 15.97,27.69 13.64,25.35 v13.64,24.82
  Bottom 0.203: U4.15 14.14,25.47 13.64,24.97 v13.64,24.82
SD_MISO  (via drill 0.33)
  Top 0.203: v15.62,24.82 15.78,24.66 16.79,24.66 17.27,25.15 18.29,25.15 18.54,24.89 18.54,23.88 18.78,23.64 RN1.7
  Top 0.254: U2.P$7 19.23,23.65 RN1.7
  Bottom 0.203: U4.17 15.14,25.58 15.62,25.11 v15.62,24.82
SD_MOSI  (via drill 0.33)
  Top 0.203: 19.18,25.78 17.14,25.78 16.76,25.4 v16.38,25.4 | 19.18,25.78 19.18,27.18 19.68,27.69 20.19,27.69 20.56,28.05 U2.P$3 | 19.18,25.78 19.18,24.48 RN1.8
  Bottom 0.203: U4.18 15.64,25.88 16.13,25.4 v16.38,25.4
  pour Top: 19.18,26.16 19.18,25.4 18.8,25.78
SD_SCLK  (via drill 0.33)
  Top 0.203: U2.P$5 22.15,25.85 23.11,24.89 23.11,20.07 22.23,19.18 22.23,17.91 20.57,16.26 v19.68,16.26
  Bottom 0.203: U4.52 18.64,15.22 v19.68,16.26
SD_SSEL  (via drill 0.33)
  Top 0.203: 21.01,29.21 U2.P$2 | U2.P$2 20.5,29.15 19.61,30.04 RN2.5 | v14.63,24.8 14.63,25.3 16.13,26.8 18.06,26.8 20.41,29.15 U2.P$2
  Bottom 0.203: U4.16 14.64,24.82 v14.63,24.8
SPI3_MISO  (via drill 0.33)
  Top 0.152: JP1.3 12.45,6.35 6.1,6.35 4.95,7.49 4.95,8.89 5.38,9.32 v5.38,10.54
  Bottom 0.152: U4.79 6.34,14.23 6.6,13.97 6.6,12.19 5.38,10.97 v5.38,10.54
SPI3_MOSI  (via drill 0.33)
  Top 0.152: v6.26,10.54 6.26,9.05 6.15,8.94 6.15,7.57 6.16,7.56 6.73,6.99 12.83,6.99 13.97,5.84 15.49,5.84 JP1.1
  Bottom 0.152: U4.80 6.6,14.73 7.05,14.29 7.05,12 6.26,11.21 v6.26,10.54
SPI3_SCLK  (via drill 0.33)
  Top 0.152: v4.51,10.54 4.51,6.92 5.84,5.59 10.67,5.59 JP1.5
  Bottom 0.152: U4.78 6.08,13.73 6.22,13.59 6.22,12.57 4.51,10.86 v4.51,10.54
SPI3_SSEL  (via drill 0.33)
  Top 0.152: JP1.7 5.97,4.45 3.94,6.48 3.94,11.3 4.06,11.43 4.06,12.19 3.92,12.34 v3.92,12.84
  Bottom 0.152: U4.77 4.31,13.23 v3.92,12.84
SWCLK
  Bottom 0.203: U4.76 4.92,12.73 4.03,11.84 JP2.5
SWDIO  (via drill 0.33)
  Top 0.203: v7.75,14.99 4.24,14.99 JP2.3
  Bottom 0.203: U4.72 8.64,14.09 v7.75,14.99
VBUS
  Bottom 0.203: U4.68 10.64,10.12 11.56,9.21 11.56,6.99 10.29,5.71 8.7,5.71 8.06,5.08 8.06,4.45 7.75,4.13 U5.2
  Bottom 0.406: D1.2 7.63,3.17 7.13,3.67 U5.2
VCAP1
  Bottom 0.305: U4.49 21.61,13.23 22.04,13.65 22.65,13.65 C13.1
VCAP2
  Bottom 0.305: U4.73 8.14,8.98 C12.1
VCC  (via drill 0.33)
  Top 0.406: RN1.1 RN1.2 RN1.3 17.29,22.84 v17.02,23.11 | v20.07,26.92 21.04,26.92 U2.P$4 | LED2.3 LED2.2 LED2.1 5.93,27.35 v6.22,27.05 | RN5.8 RN5.7 | RN5.8 18.34,7.17 v18.29,7.11 | RN5.8 18.43,8.04 U7.8 20.18,7.92 C15.1 | RN2.2 RN2.3 RN2.4 17.27,29.97 v17.2,29.97
  Bottom 0.254: C7.1 11.89,29.17 v11.93,29.21
  Bottom 0.305: C14.2 17.91,28.24 17.91,27.5 17.64,27.23 U4.22 U4.21 | 9.34,28.24 C9.1 | C7.1 11.87,28.24 11.87,27.62 12.14,27.35 U4.11 | 9.34,28.24 v9.34,29.21 | 9.34,28.24 9.34,27.62 9.64,27.31 U4.6 | v15.37,29.21 15.35,29.2 C1.2 15.37,28.24 15.37,27.81 16.14,27.04 U4.19 | U4.50 21.68,12.73 22.04,12.38 22.65,12.38 C6.2 | U4.75 7.14,10.46 6.53,9.84 5.84,9.84 5.51,9.51 C10.1 5.51,7.95 v5.52,7.94 | U4.100 4.6,24.73 4.25,25.08 3.63,25.08 C11.1 2.97,25.48 2.4,26.05 C24.2 0.77,26.05 v0.74,26.04 | U4.28 21.61,23.73 22.1,23.24 22.62,23.24 C8.2 23.73,23.29 v23.75,23.3
  Bottom 0.406: v1.59,22.99 1.66,23.04 RN3.4 RN3.3 | C14.2 17.91,28.26 v17.91,29.21 | RN3.1 1.77,20.64 v1.59,20.57 | v20.07,26.92 20.21,26.78 C3.1 23.25,26.78 23.5,26.53 C25.1 24.43,26.49 v24.43,25.5 | 22.65,12.38 23.18,12.38 23.5,12.7 C4.2 v24.38,13.72 | v23.24,2.29 23.31,2.35 U3.5 24.52,2.1 C20.1
  pour Route2 (isolate 0.203): 0,0 0,33.02 25.4,33.02 25.4,0
VIN  (via drill 0.33)
  Top 0.406: v10.54,0.86 10.19,0.86 9.96,0.64 8.51,0.64 8.19,0.95 D3.1 6.54,0.95 v6.48,1.02
  Bottom 0.406: U3.1 20.75,2.35 | U8.3 20.94,9.59 20.75,9.4 20.75,7.75 | 20.75,7.75 20.75,4.32 | 20.75,4.32 20.75,2.35 | U8.1 20.89,7.69 20.75,7.75 | U3.3 20.89,4.25 20.75,4.32 | 20.75,2.35 20.75,2.03 20.36,1.64 C16.1 18.79,1.64 17.78,0.64 11.15,0.64 10.92,0.86 v10.54,0.86 | D1.1 D2.1 5.39,1.02 v6.48,1.02
VSYNC  (via drill 0.33)
  Top 0.203: U1.P$7 10.54,17.52 v10.16,17.91
  Bottom 0.203: v10.16,17.91 6.83,21.23 U4.93
XCLK  (via drill 0.33)
  Top 0.203: U1.P$13 13.54,15.04 v13.78,15.28
  Bottom 0.203: U4.40 17.67,17.73 15.21,15.28 v13.78,15.28

### Text on the board
tPlace: SEL | SCK | SDI | SDO | VCC | GND | TXD | RXD | RESET | OpenMV | R4
bPlace: BOT | RST | VCC | SWD | GND | SWC | Debug